# EAGLE schematic rf_ib (EAGLE 5.10)
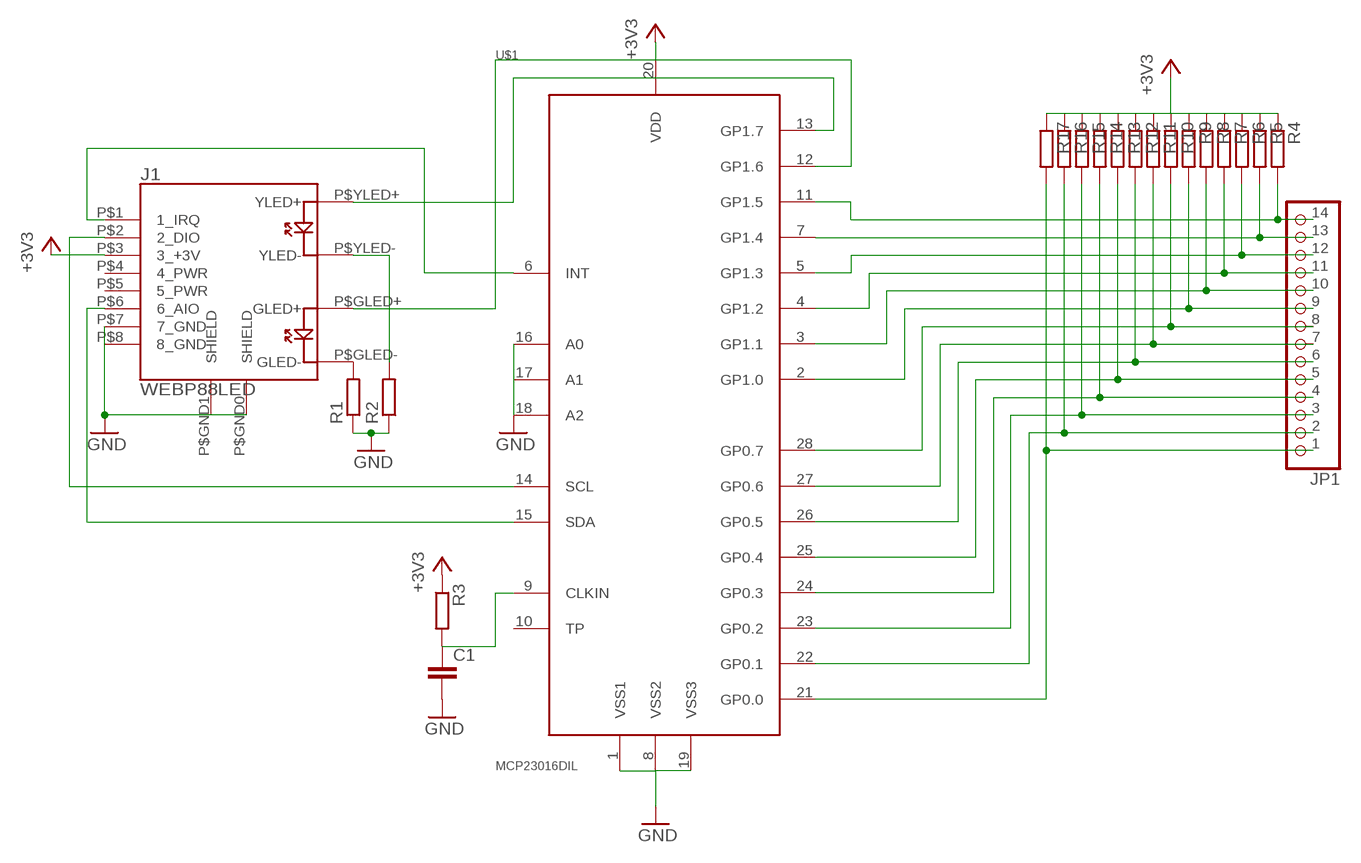
[diagram p0: schematic, sheet 1]

## Parts
C1  C-EU025-025X050  [C025-025X050]
J1  WEBP88LED  [WEBP88LED]
JP1  PINHD-1X14  [1X14]
R1  R-EU_0204/7  [0204/7]
R2  R-EU_0204/7  [0204/7]
R3  R-EU_0204/7  [0204/7]
R4  R-EU_0204/7  [0204/7]
R5  R-EU_0204/7  [0204/7]
R6  R-EU_0204/7  [0204/7]
R7  R-EU_0204/7  [0204/7]
R8  R-EU_0204/7  [0204/7]
R9  R-EU_0204/7  [0204/7]
R10  R-EU_0204/7  [0204/7]
R11  R-EU_0204/7  [0204/7]
R12  R-EU_0204/7  [0204/7]
R13  R-EU_0204/7  [0204/7]
R14  R-EU_0204/7  [0204/7]
R15  R-EU_0204/7  [0204/7]
R16  R-EU_0204/7  [0204/7]
R17  R-EU_0204/7  [0204/7]
U$1  MCP23016DIL  [DIL28-3]

## Nets
+3V3: J1.P$3(3_+3V) R3.1 R4.1 R5.1 R6.1 R7.1 R8.1 R9.1 R10.1 R11.1 R12.1 R13.1 R14.1 R15.1 R16.1 R17.1 U$1.20(VDD)
GND: C1.2 J1.P$7(7_GND) J1.P$8(8_GND) J1.P$GND0(SHIELD) J1.P$GND1(SHIELD) R1.1 R2.1 U$1.1(VSS1) U$1.8(VSS2) U$1.16(A0) U$1.17(A1) U$1.18(A2) U$1.19(VSS3)
N$1: JP1.1 R17.2 U$1.21(GP0.0)
N$2: C1.1 R3.2 U$1.9(CLKIN)
N$3: J1.P$GLED-(GLED-) R1.2
N$4: J1.P$YLED-(YLED-) R2.2
N$5: JP1.13 R5.2 U$1.7(GP1.4)
N$6: JP1.3 R15.2 U$1.23(GP0.2)
N$7: J1.P$YLED+(YLED+) U$1.13(GP1.7)
N$8: J1.P$GLED+(GLED+) U$1.12(GP1.6)
N$9: JP1.7 R11.2 U$1.27(GP0.6)
N$10: J1.P$1(1_IRQ) U$1.6(INT)
N$11: JP1.4 R14.2 U$1.24(GP0.3)
N$12: JP1.5 R13.2 U$1.25(GP0.4)
N$13: JP1.6 R12.2 U$1.26(GP0.5)
N$15: JP1.8 R10.2 U$1.28(GP0.7)
N$16: JP1.9 R9.2 U$1.2(GP1.0)
N$17: JP1.10 R8.2 U$1.3(GP1.1)
N$18: JP1.11 R7.2 U$1.4(GP1.2)
N$19: JP1.12 R6.2 U$1.5(GP1.3)
N$20: JP1.2 R16.2 U$1.22(GP0.1)
N$21: JP1.14 R4.2 U$1.11(GP1.5)
N$22: J1.P$2(2_DIO) U$1.14(SCL)
N$23: J1.P$6(6_AIO) U$1.15(SDA)
Unconnected: J1.P$4(4_PWR) J1.P$5(5_PWR) U$1.10(TP)

## Library data of the parts
C1 = resistor:C-EU: CAPACITOR, European symbol
J1 = Prcek:WEBP88LED
JP1 = pinhead:PINHD-1X14: PIN HEADER
R1-R17 = resistor:R-EU_: RESISTOR, European symbol
U$1 = microchip-nuno:MCP23016